# EAGLE schematic SevenSegment (EAGLE 7.5.0)
Jaime's Atomicon 2016 Design
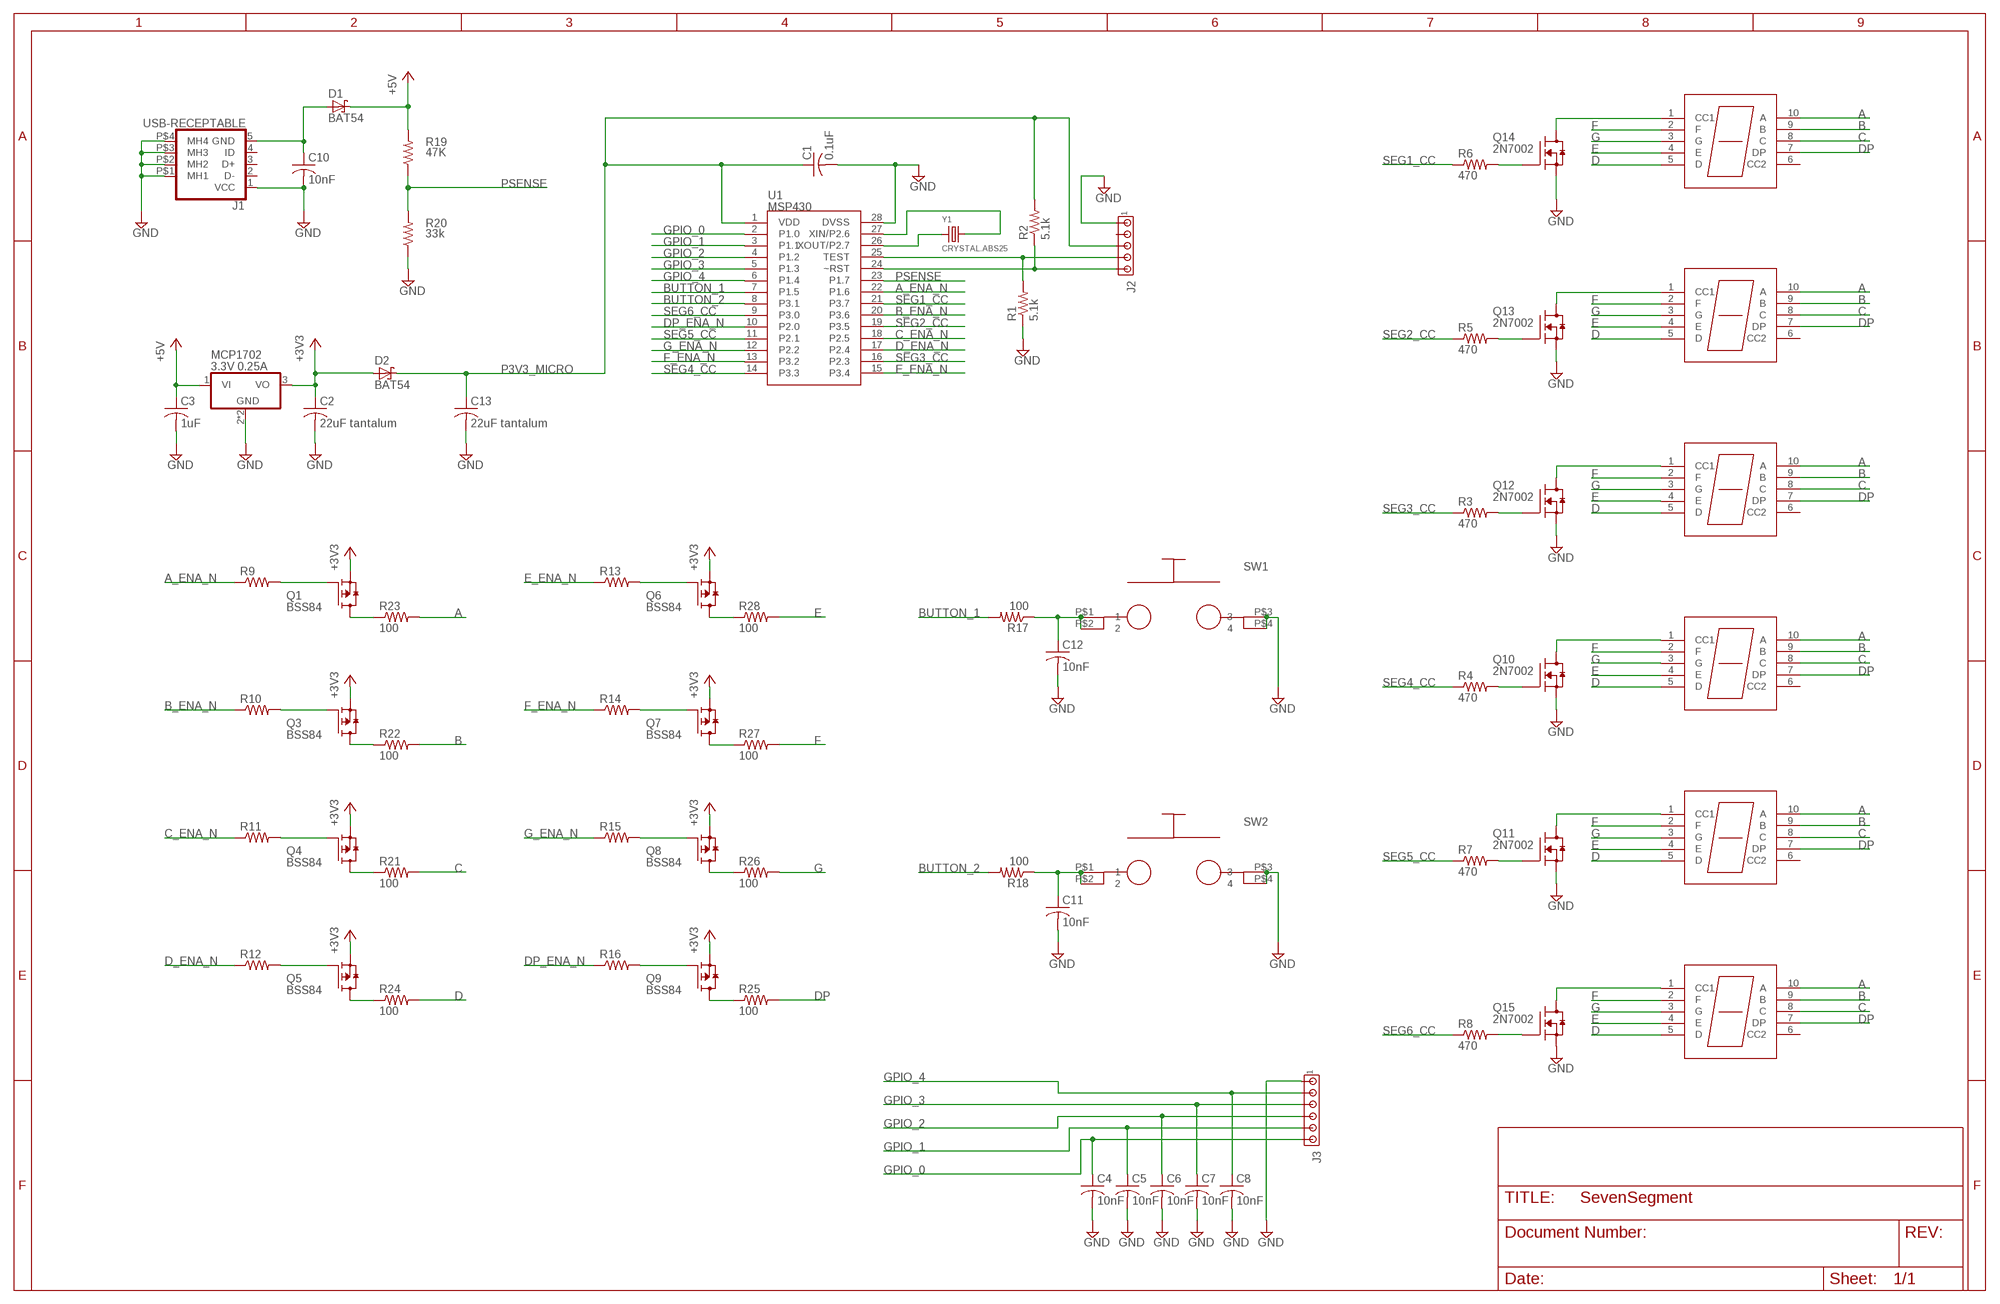
[diagram p0: schematic, sheet 1]

## Parts
C1  0.1uF  C-USC0805  [C0805]
C2  22uF tantalum  C-USC3216  [C3216]
C3  1uF  C-USC0603  [C0603]
C4  10nF  C-USC0603  [C0603]
C5  10nF  C-USC0603  [C0603]
C6  10nF  C-USC0603  [C0603]
C7  10nF  C-USC0603  [C0603]
C8  10nF  C-USC0603  [C0603]
C10  10nF  C-USC0603  [C0603]
C11  10nF  C-USC0603  [C0603]
C12  10nF  C-USC0603  [C0603]
C13  22uF tantalum  C-USC3216  [C3216]
D1  BAT54  [SOT23]
D2  BAT54  [SOT23]
DP1  SEVENSEGMENT  [LA-401]
DP2  SEVENSEGMENT  [LA-401]
DP3  SEVENSEGMENT  [LA-401]
DP4  SEVENSEGMENT  [LA-401]
DP5  SEVENSEGMENT  [LA-401]
DP6  SEVENSEGMENT  [LA-401]
J1  USB-RECEPTABLE  [FCI-10103594-0001LF]
J2  MTA05-100  [10X05MTA]
J3  MTA06-100  [10X06MTA]
Q1  BSS84  [SOT-23]
Q3  BSS84  [SOT-23]
Q4  BSS84  [SOT-23]
Q5  BSS84  [SOT-23]
Q6  BSS84  [SOT-23]
Q7  BSS84  [SOT-23]
Q8  BSS84  [SOT-23]
Q9  BSS84  [SOT-23]
Q10  2N7002  [SOT-23]
Q11  2N7002  [SOT-23]
Q12  2N7002  [SOT-23]
Q13  2N7002  [SOT-23]
Q14  2N7002  [SOT-23]
Q15  2N7002  [SOT-23]
R1  5.1k  R-US_R0603  [R0603]
R2  5.1k  R-US_R0603  [R0603]
R3  470  R-US_R0603  [R0603]
R4  470  R-US_R0603  [R0603]
R5  470  R-US_R0603  [R0603]
R6  470  R-US_R0603  [R0603]
R7  470  R-US_R0603  [R0603]
R8  470  R-US_R0603  [R0603]
R9  R-US_R0603  [R0603]
R10  R-US_R0603  [R0603]
R11  R-US_R0603  [R0603]
R12  R-US_R0603  [R0603]
R13  R-US_R0603  [R0603]
R14  R-US_R0603  [R0603]
R15  R-US_R0603  [R0603]
R16  R-US_R0603  [R0603]
R17  100  R-US_R0603  [R0603]
R18  100  R-US_R0603  [R0603]
R19  47K  R-US_R0603  [R0603]
R20  33k  R-US_R0603  [R0603]
R21  100  R-US_R0603  [R0603]
R22  100  R-US_R0603  [R0603]
R23  100  R-US_R0603  [R0603]
R24  100  R-US_R0603  [R0603]
R25  100  R-US_R0603  [R0603]
R26  100  R-US_R0603  [R0603]
R27  100  R-US_R0603  [R0603]
R28  100  R-US_R0603  [R0603]
SW1  BUTTON  [TL6100CF300QP]
SW2  BUTTON  [TL6100CF300QP]
U1  MSP430  MICRO  [TSSOP28]
U12  VOLTAGEREG  [SOT223]
Y1  CRYSTAL.ABS25  [ABS25]

## Nets
+3V3 [power]: C2.1 D2.1(A) Q1.2(S) Q3.2(S) Q4.2(S) Q5.2(S) Q6.2(S) Q7.2(S) Q8.2(S) Q9.2(S) U12.3(VO)
+5V [power]: C3.1 D1.3(C) R19.2 U12.1(VI)
A: DP1.10(A) DP2.10(A) DP3.10(A) DP4.10(A) DP5.10(A) DP6.10(A) R23.2
A_ENA_N: R9.1 U1.22(P1.6)
B: DP1.9(B) DP2.9(B) DP3.9(B) DP4.9(B) DP5.9(B) DP6.9(B) R22.2
B_ENA_N: R10.1 U1.20(P3.6)
BUTTON_1: R17.2 U1.7(P1.5)
BUTTON_2: R18.2 U1.8(P3.1)
C: DP1.8(C) DP2.8(C) DP3.8(C) DP4.8(C) DP5.8(C) DP6.8(C) R21.2
C_ENA_N: R11.1 U1.18(P2.5)
D: DP1.5(D) DP2.5(D) DP3.5(D) DP4.5(D) DP5.5(D) DP6.5(D) R24.2
D_ENA_N: R12.1 U1.17(P2.4)
DP: DP1.7(DP) DP2.7(DP) DP3.7(DP) DP4.7(DP) DP5.7(DP) DP6.7(DP) R25.2
DP_ENA_N: R16.1 U1.10(P2.0)
E: DP1.4(E) DP2.4(E) DP3.4(E) DP4.4(E) DP5.4(E) DP6.4(E) R28.2
E_ENA_N: R13.1 U1.15(P3.4)
F: DP1.2(F) DP2.2(F) DP3.2(F) DP4.2(F) DP5.2(F) DP6.2(F) R27.2
F_ENA_N: R14.1 U1.13(P3.2)
G: DP1.3(G) DP2.3(G) DP3.3(G) DP4.3(G) DP5.3(G) DP6.3(G) R26.2
G_ENA_N: R15.1 U1.12(P2.2)
GND [power]: C1.2 C2.2 C3.2 C4.2 C5.2 C6.2 C7.2 C8.2 C10.2 C11.2 C12.2 C13.2 J1.1(VCC) J1.P$1(MH1) J1.P$2(MH2) J1.P$3(MH3) J1.P$4(MH4) J2.1 J3.1 Q10.2(S) Q11.2(S) Q12.2(S) Q13.2(S) Q14.2(S) Q15.2(S) R1.1 R20.1 SW1.P$3 SW1.P$4 SW2.P$3 SW2.P$4 U1.28(DVSS) U12.2(GND) U12.4(GND)
GPIO_0: C4.1 J3.6 U1.2(P1.0)
GPIO_1: C5.1 J3.5 U1.3(P1.1)
GPIO_2: C6.1 J3.4 U1.4(P1.2)
GPIO_3: C7.1 J3.3 U1.5(P1.3)
GPIO_4: C8.1 J3.2 U1.6(P1.4)
N$1: J2.5 R2.1 U1.24(~RST)
N$2: U1.27(XIN/P2.6) Y1.4
N$3: U1.26(XOUT/P2.7) Y1.1
N$4: J2.4 R1.2 U1.25(TEST)
N$5: DP6.1(CC1) Q15.3(D)
N$6: DP1.1(CC1) Q14.3(D)
N$7: DP2.1(CC1) Q13.3(D)
N$8: DP3.1(CC1) Q12.3(D)
N$9: DP4.1(CC1) Q10.3(D)
N$10: DP5.1(CC1) Q11.3(D)
N$11: Q15.1(G) R8.2
N$12: Q11.1(G) R7.2
N$13: Q10.1(G) R4.2
N$14: Q13.1(G) R5.2
N$15: Q12.1(G) R3.2
N$16: Q14.1(G) R6.2
N$17: C11.1 R18.1 SW2.P$1 SW2.P$2
N$18: C12.1 R17.1 SW1.P$1 SW1.P$2
N$19: Q3.1(G) R10.2
N$20: Q4.1(G) R11.2
N$21: Q5.1(G) R12.2
N$22: Q6.1(G) R13.2
N$23: Q7.1(G) R14.2
N$24: Q8.1(G) R15.2
N$25: Q9.1(G) R16.2
N$26 [power]: C10.1 D1.1(A) J1.5(GND)
N$27: Q5.3(D) R24.1
N$28: Q1.1(G) R9.2
N$29: Q4.3(D) R21.1
N$30: Q3.3(D) R22.1
N$31: Q1.3(D) R23.1
N$32: Q6.3(D) R28.1
N$33: Q7.3(D) R27.1
N$34: Q8.3(D) R26.1
N$35: Q9.3(D) R25.1
P3V3_MICRO [power]: C1.1 C13.1 D2.3(C) J2.3 R2.2 U1.1(VDD)
PSENSE: R19.1 R20.2 U1.23(P1.7)
SEG1_CC: R6.1 U1.21(P3.7)
SEG2_CC: R5.1 U1.19(P3.5)
SEG3_CC: R3.1 U1.16(P2.3)
SEG4_CC: R4.1 U1.14(P3.3)
SEG5_CC: R7.1 U1.11(P2.1)
SEG6_CC: R8.1 U1.9(P3.0)
Unconnected: DP1.6(CC2) DP2.6(CC2) DP3.6(CC2) DP4.6(CC2) DP5.6(CC2) DP6.6(CC2) J1.2(D-) J1.3(D+) J1.4(ID) J2.2

## Library data of the parts
C1-C8 C10-C13 = AtomicCon:C-US: CAPACITOR, American symbol
D1 D2 = diode:BAT54: Schottky Diodes Source: Fairchild .. BAT54.pdf
DP1-DP6 = AtomicCon:SEVENSEGMENT
J1 = AtomicCon:USB-RECEPTABLE: USB Receptable
J2 = AtomicCon:MTA05-100: AMP connector
J3 = AtomicCon:MTA06-100: AMP connector Connection corrected 2014-09-19
Q1 Q3-Q9 = AtomicCon:BSS84: BSS84 P-channel MOSFET
Q10-Q15 = AtomicCon:2N7002: 300 mA N-channel MOSFET
R1-R28 = AtomicCon:R-US_: RESISTOR, American symbol
SW1 SW2 = AtomicCon:BUTTON
U1 = AtomicCon:MICRO
U12 = AtomicCon:VOLTAGEREG: http://ww1.microchip.com/downloads/en/DeviceDoc/mic5209.pdf
Y1 = abracon:CRYSTAL

## Net classes
0 default: width 0.203 mm, drill 0.508 mm
1 power: width 0.305 mm, drill 0.508 mm, clearance 0.203 mm to class 0, clearance 0.203 mm